# Altium project PCB_Project.PrjPcb
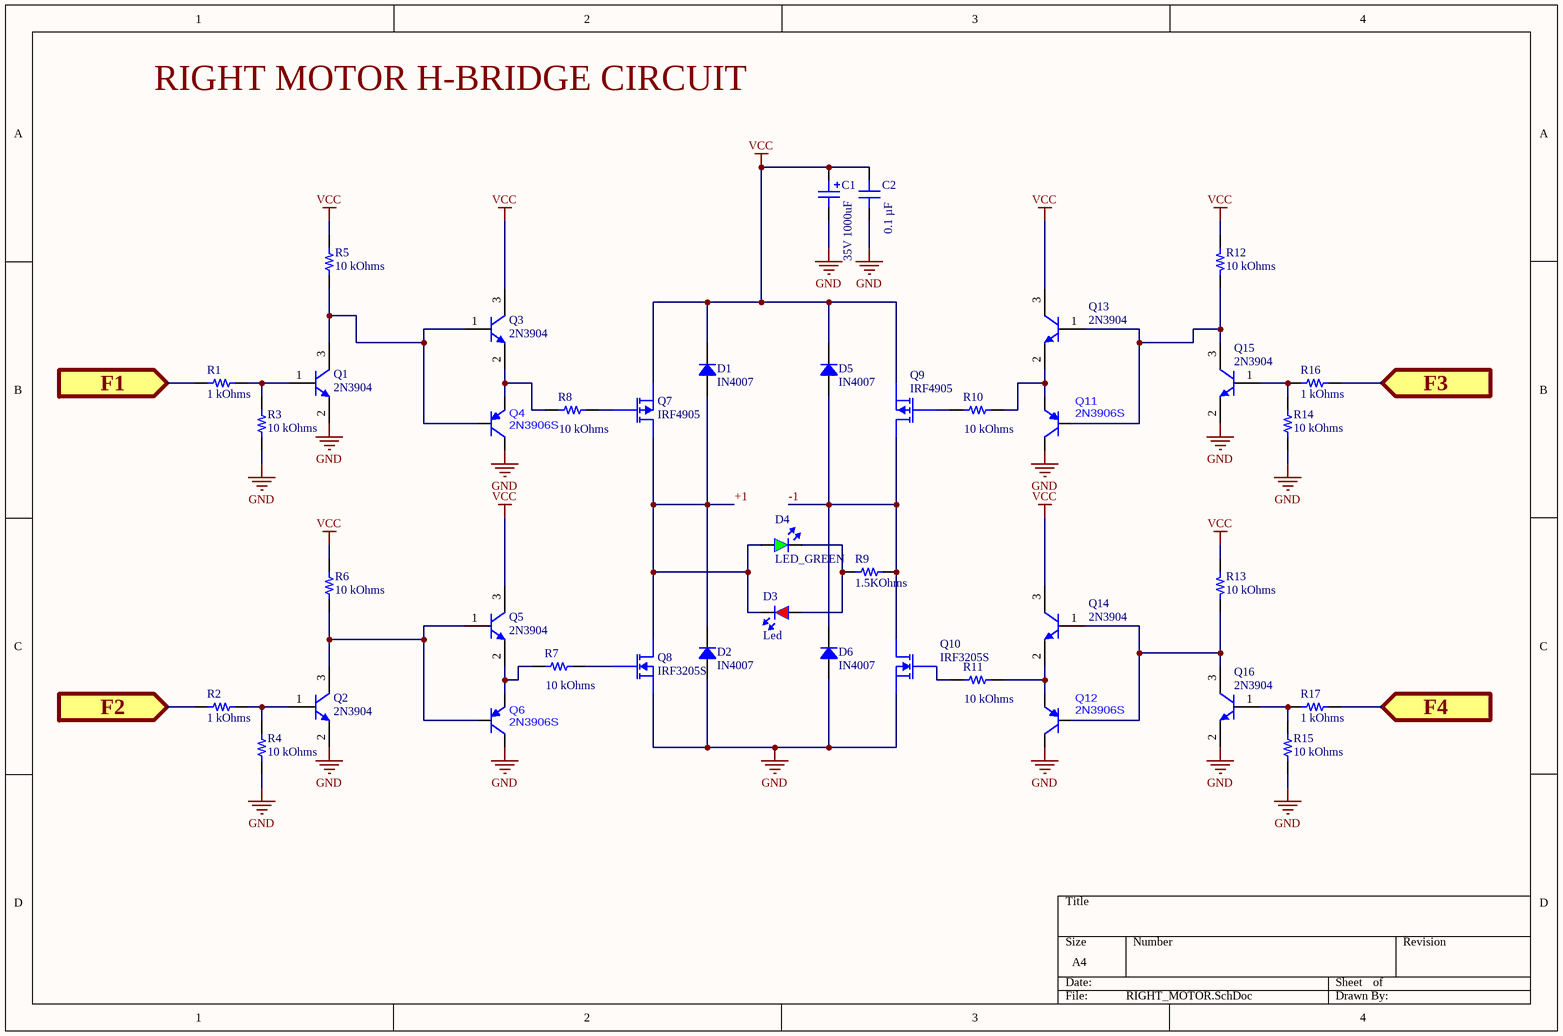
[diagram p0: RIGHT_MOTOR.SchDoc]
3 sheets, 114 parts. Net scope: global (net labels, ports and power ports of the same name join across sheets).
Board file: HBRIDGE_PCB.PcbDoc
Sheets:
  RIGHT_MOTOR.SchDoc
  LEFT_MOTOR.SchDoc
  LOGIC AND POWER.SchDoc

## Sheet RIGHT_MOTOR.SchDoc
size A4; SheetNumber: 1; SheetTotal: 3

### Parts
C1  35V 1000uF  [35V 1000uF]
C2  0.1 µF  [CAP 1210_3225 - 1MM]
D1  IN4007  [DO214AC SMA]
D2  IN4007  [DO214AC SMA]
D3  Led  [LED_RED]
D4  LED_GREEN  [LED_GREEN]
D5  IN4007  [DO214AC SMA]
D6  IN4007  [DO214AC SMA]
Q1  2N3904  [DIODES SOT-23-3]
Q2  2N3904  [DIODES SOT-23-3]
Q3  2N3904  [DIODES SOT-23-3]
Q4  2N3906S  [SOT23-3]
Q5  2N3904  [DIODES SOT-23-3]
Q6  2N3906S  [SOT23-3]
Q7  IRF4905  [IRF4905]
Q8  IRF3205S  [IRF3205S]
Q9  IRF4905  [IRF4905]
Q10  IRF3205S  [IRF3205S]
Q11  2N3906S  [SOT23-3]
Q12  2N3906S  [SOT23-3]
Q13  2N3904  [DIODES SOT-23-3]
Q14  2N3904  [DIODES SOT-23-3]
Q15  2N3904  [DIODES SOT-23-3]
Q16  2N3904  [DIODES SOT-23-3]
R1  1 kOhms  [RES 1206_3216]
R2  1 kOhms  [RES 1206_3216]
R3  10 kOhms  [RES 1206_3216]
R4  10 kOhms  [RES 1206_3216]
R5  10 kOhms  [RES 1210_3225]
R6  10 kOhms  [RES 1210_3225]
R7  10 kOhms  [RES 1210_3225]
R8  10 kOhms  [RES 1210_3225]
R9  1.5KOhms  [RES 1210_3225]
R10  10 kOhms  [RES 1210_3225]
R11  10 kOhms  [RES 1210_3225]
R12  10 kOhms  [RES 1210_3225]
R13  10 kOhms  [RES 1210_3225]
R14  10 kOhms  [RES 1206_3216]
R15  10 kOhms  [RES 1206_3216]
R16  1 kOhms  [RES 1206_3216]
R17  1 kOhms  [RES 1206_3216]

### Ports
F1 (in, see LOGIC AND POWER[2D]), F2 (in, see LOGIC AND POWER[2C], LOGIC AND POWER[2D]), F3 (in, see LOGIC AND POWER[2D]), F4 (in, see LOGIC AND POWER[2C], LOGIC AND POWER[2D])

### Nets
GND: C1.2(out) C2.1 D2.1 D6.1 Q1.2(E) Q2.2(E) Q4.3(C) Q6.3(C) Q8.3(S) Q10.3(S) Q11.3(C) Q12.3(C) Q15.2(E) Q16.2(E) R3.1 R4.1 R14.1 R15.1
VCC: C1.1(in) C2.2 D1.2 D5.2 Q3.3(C) Q5.3(C) Q7.3(S) Q9.3(S) Q13.3(C) Q14.3(C) R5.1 R6.1 R12.1 R13.1
+1: D1.1 D2.2 D3.2(OUT) D4.1(IN) Q7.2(D) Q8.2(D)
-1: D5.1 D6.2 Q9.2(D) Q10.2(D) R9.2
NetD3_1: D3.1(IN) D4.2(OUT) R9.1
NetIC1_3: R17.2 ; port F4
NetIC1_6: R2.1 ; port F2
NetIC2_4: R1.1 ; port F1
NetIC2_6: R16.2 ; port F3
NetQ1_1: Q1.1(B) R1.2 R3.2
NetQ1_3: Q1.3(C) Q3.1(B) Q4.1(B) R5.2
NetQ2_1: Q2.1(B) R2.2 R4.2
NetQ2_3: Q2.3(C) Q5.1(B) Q6.1(B) R6.2
NetQ3_2: Q3.2(E) Q4.2(E) R8.1
NetQ5_2: Q5.2(E) Q6.2(E) R7.1
NetQ7_1: Q7.1(G) R8.2
NetQ8_1: Q8.1(G) R7.2
NetQ9_1: Q9.1(G) R10.1
NetQ10_1: Q10.1(G) R11.1
NetQ11_1: Q11.1(B) Q13.1(B) Q15.3(C) R12.2
NetQ11_2: Q11.2(E) Q13.2(E) R10.2
NetQ12_1: Q12.1(B) Q14.1(B) Q16.3(C) R13.2
NetQ12_2: Q12.2(E) Q14.2(E) R11.2
NetQ15_1: Q15.1(B) R14.2 R16.1
NetQ16_1: Q16.1(B) R15.2 R17.1

### Notes on the sheet
- Labels drawn without touching a wire or pin: RIGHT MOTOR H-BRIDGE CIRCUIT

### Library data of the parts
C2 = 1210Y0500104KST: 1210 50VDC 100NF 10% X7R(2R1) AE; manufacturer: Knowles Syfer; Voltage - Rated: 50V; Part Number: 1210Y0500104KST; Value: 0.1 µF; Applications: Automotive, Boardflex Sensitive; Capacitance: 0.1 µF; componentlink2description: DigiKey Link; componentlink2url: https://www.digikey.com/en/products/detail/knowles-syfer/1210Y0500104KST/18879780; Device Package: 1210 (3225 Metric); Features: Soft Termination; lastupdated: 4.12.2023 20:40:02; Lifecycle Status: Active; Minimum Order: 1; Mounting Type: Surface Mount, MLCC; Operating Temperature: -55°C ~ 125°C; Package / Case: 1210 (3225 Metric); packaging: TapeAndReel; partid: 53037; Part Status: Active; price: 0.16; Ratings: AEC-Q200; series: FlexiCap™; Size / Dimension: 0.126" L x 0.098" W (3.20mm x 2.50mm); Supplier 1: DigiKey; Supplier Part Number 1: 1608-1210Y0500104KSTCT-ND; Temperature Coefficient: X7R (2R1); Thickness (Max): 0.079" (2.00mm); Tolerance: ±10%
D1 D2 D5 D6 = RS1A: DIODE GEN PURP 50V 1A SMA; Part Number: RS1A; Manufacturer: ON Semiconductor; Capacitance @ Vr, F: 10pF @ 4V, 1MHz; Current - Reverse Leakage @ Vr: 5µA @ 50V; Diode Type: Standard; Reverse Recovery Time (trr): 150ns; Speed: Fast Recovery =< 500ns, > 200mA (Io); Voltage - Forward (Vf) (Max) @ If: 1.3V @ 1A; ComponentLink1Description: Datasheet; ComponentLink1URL: https://www.onsemi.com/pub/Collateral/RS1M-D.PDF; ComponentLink2Description: DigiKey Link; ComponentLink2URL: http://digikey.com/product-detail/en/on-semiconductor/RS1A/RS1ACT-ND/3504478; Current - Average Rectified (Io): 1A; LastUpdated: 4.12.2023 21:20:44; Lifecycle Status: Active; Minimum Order: 1; Mounting Type: Surface Mount; Operating Temperature - Junction: -55°C ~ 150°C; Package / Case: DO-214AC, SMA; Packaging: TapeAndReel; PartId: 585; Part Status: Active; Price: 0.08; Series: -; Supplier 1: DigiKey; Supplier Part Number 1: RS1ACT-ND; Supplier Device Package: SMA (DO-214AC); Voltage - DC Reverse (Vr) (Max): 50V
D3 = LED_RED_1
Q1-Q3 Q5 Q13-Q16 = MMBT3904-7-F: 2N3904 Npn Smd Transistör Sot-23; Manufacturer: Diodes Incorporated; Current - Collector Cutoff (Max): 50nA (ICBO); Current - Collector (Ic) (Max): 200 mA; DC Current Gain (hFE) (Min) @ Ic, Vce: 100 @ 10mA, 1V; Frequency - Transition: 300MHz; Power - Max: 300 mW; Vce Saturation (Max) @ Ib, Ic: 300mV @ 5mA, 50mA; Voltage - Collector Emitter Breakdown (Max): 40 V; Part Number: MMBT3904-7-F; ComponentLink1Description: Datasheet; ComponentLink1URL: https://www.diodes.com/assets/Datasheets/ds30036.pdf; ComponentLink2Description: DigiKey Link; ComponentLink2URL: https://www.digikey.com/en/products/detail/diodes-incorporated/MMBT3904-7-F/814494; LastUpdated: 4.12.2023 21:46:05; Lifecycle Status: Active; Minimum Order: 1; Mounting Type: Surface Mount; Operating Temperature: -55°C ~ 150°C (TJ); Package / Case: TO-236-3, SC-59, SOT-23-3; Packaging: TapeAndReel; PartId: 85; Part Status: Active; Price: 0.01; Series: -; Supplier 1: DigiKey; Supplier Part Number 1: MMBT3904-FDICT-ND; Supplier Device Package: SOT-23-3; Transistor Type: NPN
R1 R2 R16 R17 = RNCS1206BKE1K00: RES 1K OHM 0.1% 1/8W 1206; Manufacturer: Stackpole Electronics Inc; Power (Watts): 0.125W, 1/8W; Temperature Coefficient: ±25ppm/°C; Part Number: RNCS1206BKE1K00; ComponentLink1Description: Datasheet; ComponentLink1URL: https://www.seielect.com/catalog/sei-rncs_rnch.pdf; ComponentLink2Description: DigiKey Link; ComponentLink2URL: https://www.digikey.com/en/products/detail/stackpole-electronics-inc/RNCS1206BKE1K00/1800333; Composition: Thin Film; Device Package: 1206 (3216 Metric); Features: Anti-Corrosive, Automotive AEC-Q200, Moisture Resistant; Height - Seated (Max): 0.026" (0.65mm); LastUpdated: 4.12.2023 20:49:28; Lifecycle Status: Active; Minimum Order: 1; Number of Terminations: 2; Operating Temperature: -55°C ~ 155°C; Package / Case: 1206 (3216 Metric); Packaging: TapeAndReel; PartId: 26856; Part Status: Active; Price: 0.08; Ratings: AEC-Q200; Resistance: 1 kOhms; Series: RNCS; Size / Dimension: 0.120" L x 0.061" W (3.05mm x 1.55mm); Supplier 1: DigiKey; Supplier Part Number 1: RNCS1206BKE1K00CT-ND; Supplier Device Package: 1206; Tolerance: ±0.1%; Value: 1 kOhms
R3 R4 R14 R15 = CRG1206F10K: RES SMD 10K OHM 1% 1/4W 1206; Manufacturer: TE Connectivity Passive Product; Power (Watts): 0.25W, 1/4W; Temperature Coefficient: ±100ppm/°C; Part Number: CRG1206F10K; ComponentLink1Description: Datasheet; ComponentLink1URL: https://www.te.com/commerce/DocumentDelivery/DDEController?Action=srchrtrv&DocNm=1773204&DocType=DS&DocLang=English; ComponentLink2Description: DigiKey Link; ComponentLink2URL: https://www.digikey.com/en/products/detail/te-connectivity-passive-product/CRG1206F10K/2389909; Composition: Thick Film; Device Package: 1206 (3216 Metric); Height - Seated (Max): 0.026" (0.65mm); LastUpdated: 10.12.2023 20:48:33; Lifecycle Status: Active; Minimum Order: 1; Number of Terminations: 2; Operating Temperature: -55°C ~ 155°C; Package / Case: 1206 (3216 Metric); Packaging: TapeAndReel; PartId: 26989; Part Status: Active; Price: 0.01; Resistance: 10 kOhms; Series: CRG, Neohm; Size / Dimension: 0.122" L x 0.061" W (3.10mm x 1.55mm); Supplier 1: DigiKey; Supplier Part Number 1: A106069CT-ND; Supplier Device Package: 1206; Tolerance: ±1%; Value: 10 kOhms
R5 R6 R12 R13 = CRCW121010K0JNEAHP: RES SMD 10K OHM 5% 3/4W 1210; Manufacturer: Vishay Dale; Power (Watts): 0.75W, 3/4W; Temperature Coefficient: ±200ppm/°C; Part Number: CRCW121010K0JNEAHP; ComponentLink1Description: Datasheet; ComponentLink1URL: http://www.vishay.com/docs/20043/crcwhpe3.pdf; ComponentLink2Description: DigiKey Link; ComponentLink2URL: https://www.digikey.com/en/products/detail/vishay-dale/CRCW121010K0JNEAHP/2567300; Composition: Thick Film; Device Package: 1210 (3225 Metric); Features: Automotive AEC-Q200, Pulse Withstanding; Height - Seated (Max): 0.028" (0.70mm); LastUpdated: 4.12.2023 21:41:47; Lifecycle Status: Active; Minimum Order: 1; Number of Terminations: 2; Operating Temperature: -55°C ~ 155°C; Package / Case: 1210 (3225 Metric); Packaging: TapeAndReel; Part Status: Active; Price: 0.12; Ratings: AEC-Q200; Resistance: 10 kOhms; Series: CRCW-HP; Size / Dimension: 0.126" L x 0.098" W (3.20mm x 2.50mm); Supplier 1: DigiKey; Supplier Part Number 1: 541-10KNCT-ND; Supplier Device Package: 1210; Tolerance: ±5%; Value: 10 kOhms
R7 R8 R10 R11 = RMCF1210FT10K0: RES 10K OHM 1% 1/2W 1210; Manufacturer: Stackpole Electronics Inc; Power (Watts): 0.5W, 1/2W; Temperature Coefficient: ±100ppm/°C; Part Number: RMCF1210FT10K0; ComponentLink1Description: Datasheet; ComponentLink1URL: https://www.seielect.com/catalog/sei-rmcf_rmcp.pdf; ComponentLink2Description: DigiKey Link; ComponentLink2URL: https://www.digikey.com/en/products/detail/stackpole-electronics-inc/RMCF1210FT10K0/1758528; Composition: Thick Film; Device Package: 1210 (3225 Metric); Features: Automotive AEC-Q200; Height - Seated (Max): 0.028" (0.70mm); LastUpdated: 10.12.2023 21:39:36; Lifecycle Status: Active; Minimum Order: 1; Number of Terminations: 2; Operating Temperature: -55°C ~ 155°C; Package / Case: 1210 (3225 Metric); Packaging: TapeAndReel; Part Status: Active; Price: 0.01; Ratings: AEC-Q200; Resistance: 10 kOhms; Series: RMCF; Size / Dimension: 0.126" L x 0.098" W (3.20mm x 2.50mm); Supplier 1: DigiKey; Supplier Part Number 1: RMCF1210FT10K0CT-ND; Supplier Device Package: 1210; Tolerance: ±1%; Value: 10 kOhms
R9 = RMCF1210FT10K0: RES 1.5K OHM 1% 1/2W 1210; Manufacturer: Stackpole Electronics Inc; Power (Watts): 0.5W, 1/2W; Resistance: 10 kOhms; Temperature Coefficient: ±100ppm/°C; Value: 10 kOhms; Part Number: RMCF1210FT10K0; ComponentLink1Description: Datasheet; ComponentLink1URL: https://www.seielect.com/catalog/sei-rmcf_rmcp.pdf; ComponentLink2Description: DigiKey Link; ComponentLink2URL: https://www.digikey.com/en/products/detail/stackpole-electronics-inc/RMCF1210FT10K0/1758528; Composition: Thick Film; Device Package: 1210 (3225 Metric); Features: Automotive AEC-Q200; Height - Seated (Max): 0.028" (0.70mm); LastUpdated: 4.12.2023 21:41:44; Lifecycle Status: Active; Minimum Order: 1; Number of Terminations: 2; Operating Temperature: -55°C ~ 155°C; Package / Case: 1210 (3225 Metric); Packaging: TapeAndReel; Part Status: Active; Price: 0.01; Ratings: AEC-Q200; Series: RMCF; Size / Dimension: 0.126" L x 0.098" W (3.20mm x 2.50mm); Supplier 1: DigiKey; Supplier Part Number 1: RMCF1210FT10K0CT-ND; Supplier Device Package: 1210; Tolerance: ±1%

## Sheet LEFT_MOTOR.SchDoc
size A4; SheetNumber: 2; SheetTotal: 3
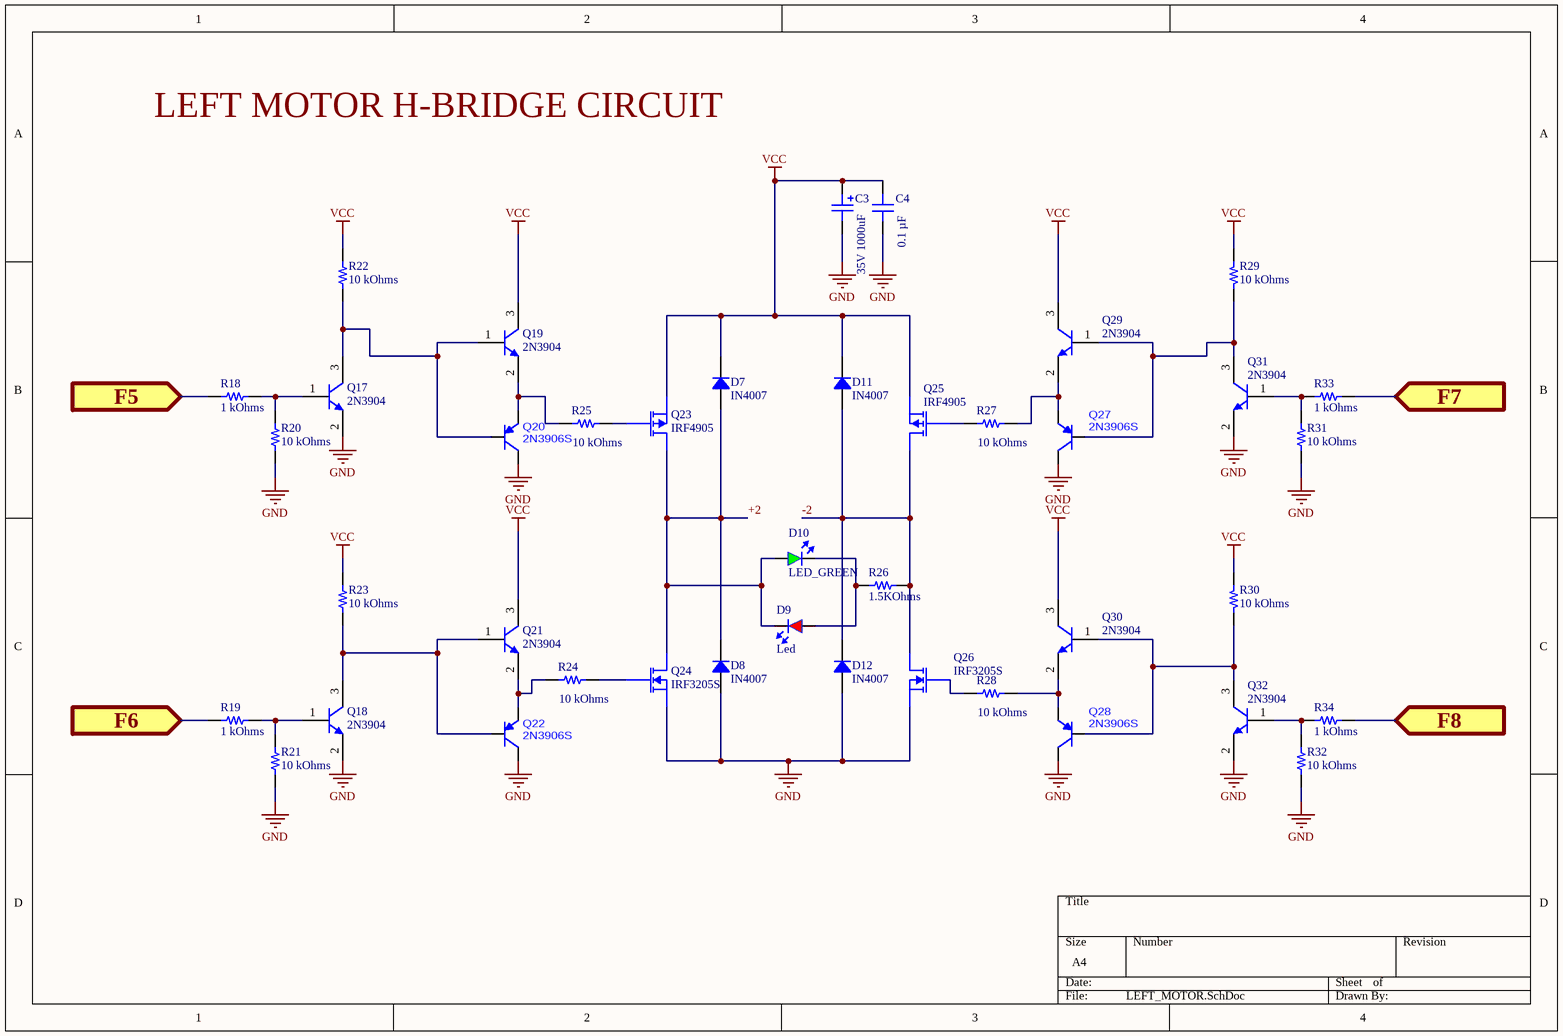
[diagram p1: LEFT_MOTOR.SchDoc]

### Parts
C3  35V 1000uF  [35V 1000uF]
C4  0.1 µF  [CAP 1210_3225 - 1MM]
D7  IN4007  [DO214AC SMA]
D8  IN4007  [DO214AC SMA]
D9  Led  [LED_RED]
D10  LED_GREEN  [LED_GREEN]
D11  IN4007  [DO214AC SMA]
D12  IN4007  [DO214AC SMA]
Q17  2N3904  [DIODES SOT-23-3]
Q18  2N3904  [DIODES SOT-23-3]
Q19  2N3904  [DIODES SOT-23-3]
Q20  2N3906S  [SOT23-3]
Q21  2N3904  [DIODES SOT-23-3]
Q22  2N3906S  [SOT23-3]
Q23  IRF4905  [IRF4905]
Q24  IRF3205S  [IRF3205S]
Q25  IRF4905  [IRF4905]
Q26  IRF3205S  [IRF3205S]
Q27  2N3906S  [SOT23-3]
Q28  2N3906S  [SOT23-3]
Q29  2N3904  [DIODES SOT-23-3]
Q30  2N3904  [DIODES SOT-23-3]
Q31  2N3904  [DIODES SOT-23-3]
Q32  2N3904  [DIODES SOT-23-3]
R18  1 kOhms  [RES 1206_3216]
R19  1 kOhms  [RES 1206_3216]
R20  10 kOhms  [RES 1206_3216]
R21  10 kOhms  [RES 1206_3216]
R22  10 kOhms  [RES 1210_3225]
R23  10 kOhms  [RES 1210_3225]
R24  10 kOhms  [RES 1210_3225]
R25  10 kOhms  [RES 1210_3225]
R26  1.5KOhms  [RES 1210_3225]
R27  10 kOhms  [RES 1210_3225]
R28  10 kOhms  [RES 1210_3225]
R29  10 kOhms  [RES 1210_3225]
R30  10 kOhms  [RES 1210_3225]
R31  10 kOhms  [RES 1206_3216]
R32  10 kOhms  [RES 1206_3216]
R33  1 kOhms  [RES 1206_3216]
R34  1 kOhms  [RES 1206_3216]

### Ports
F5 (in, see LOGIC AND POWER[2D]), F6 (in, see LOGIC AND POWER[2C], LOGIC AND POWER[2D]), F7 (in, see LOGIC AND POWER[2D]), F8 (in, see LOGIC AND POWER[2C], LOGIC AND POWER[2D])

### Nets
GND: C3.2(out) C4.1 D8.1 D12.1 Q17.2(E) Q18.2(E) Q20.3(C) Q22.3(C) Q24.3(S) Q26.3(S) Q27.3(C) Q28.3(C) Q31.2(E) Q32.2(E) R20.1 R21.1 R31.1 R32.1
VCC: C3.1(in) C4.2 D7.2 D11.2 Q19.3(C) Q21.3(C) Q23.3(S) Q25.3(S) Q29.3(C) Q30.3(C) R22.1 R23.1 R29.1 R30.1
+2: D7.1 D8.2 D9.2(OUT) D10.1(IN) Q23.2(D) Q24.2(D)
-2: D11.1 D12.2 Q25.2(D) Q26.2(D) R26.2
NetD9_1: D9.1(IN) D10.2(OUT) R26.1
NetIC1_8: R34.2 ; port F8
NetIC1_11: R19.1 ; port F6
NetIC2_8: R33.2 ; port F7
NetIC2_10: R18.1 ; port F5
NetQ17_1: Q17.1(B) R18.2 R20.2
NetQ17_3: Q17.3(C) Q19.1(B) Q20.1(B) R22.2
NetQ18_1: Q18.1(B) R19.2 R21.2
NetQ18_3: Q18.3(C) Q21.1(B) Q22.1(B) R23.2
NetQ19_2: Q19.2(E) Q20.2(E) R25.1
NetQ21_2: Q21.2(E) Q22.2(E) R24.1
NetQ23_1: Q23.1(G) R25.2
NetQ24_1: Q24.1(G) R24.2
NetQ25_1: Q25.1(G) R27.1
NetQ26_1: Q26.1(G) R28.1
NetQ27_1: Q27.1(B) Q29.1(B) Q31.3(C) R29.2
NetQ27_2: Q27.2(E) Q29.2(E) R27.2
NetQ28_1: Q28.1(B) Q30.1(B) Q32.3(C) R30.2
NetQ28_2: Q28.2(E) Q30.2(E) R28.2
NetQ31_1: Q31.1(B) R31.2 R33.1
NetQ32_1: Q32.1(B) R32.2 R34.1

### Notes on the sheet
- Labels drawn without touching a wire or pin: LEFT MOTOR H-BRIDGE CIRCUIT

### Library data of the parts
C4 = 1210Y0500104KST: as C2 on sheet RIGHT_MOTOR; Part Number: 1210Y0500104KST; Value: 0.1 µF; Applications: Automotive, Boardflex Sensitive; Capacitance: 0.1 µF; componentlink2description: DigiKey Link; componentlink2url: https://www.digikey.com/en/products/detail/knowles-syfer/1210Y0500104KST/18879780; Device Package: 1210 (3225 Metric); Features: Soft Termination; lastupdated: 4.12.2023 20:40:02; Lifecycle Status: Active; Minimum Order: 1; Mounting Type: Surface Mount, MLCC; Operating Temperature: -55°C ~ 125°C; Package / Case: 1210 (3225 Metric); packaging: TapeAndReel; partid: 53037; Part Status: Active; price: 0.16; Ratings: AEC-Q200; series: FlexiCap™; Size / Dimension: 0.126" L x 0.098" W (3.20mm x 2.50mm); Supplier 1: DigiKey; Supplier Part Number 1: 1608-1210Y0500104KSTCT-ND; Temperature Coefficient: X7R (2R1); Thickness (Max): 0.079" (2.00mm); Tolerance: ±10%
D7 D8 D11 D12 = RS1A: as D1 on sheet RIGHT_MOTOR; ComponentLink1Description: Datasheet; ComponentLink1URL: https://www.onsemi.com/pub/Collateral/RS1M-D.PDF; ComponentLink2Description: DigiKey Link; ComponentLink2URL: http://digikey.com/product-detail/en/on-semiconductor/RS1A/RS1ACT-ND/3504478; Current - Average Rectified (Io): 1A; LastUpdated: 4.12.2023 21:20:44; Lifecycle Status: Active; Minimum Order: 1; Mounting Type: Surface Mount; Operating Temperature - Junction: -55°C ~ 150°C; Package / Case: DO-214AC, SMA; Packaging: TapeAndReel; PartId: 585; Part Status: Active; Price: 0.08; Series: -; Supplier 1: DigiKey; Supplier Part Number 1: RS1ACT-ND; Supplier Device Package: SMA (DO-214AC); Voltage - DC Reverse (Vr) (Max): 50V
D9 = LED_RED_1
Q17-Q19 Q21 Q29-Q32 = MMBT3904-7-F: as Q1 on sheet RIGHT_MOTOR; Part Number: MMBT3904-7-F; ComponentLink1Description: Datasheet; ComponentLink1URL: https://www.diodes.com/assets/Datasheets/ds30036.pdf; ComponentLink2Description: DigiKey Link; ComponentLink2URL: https://www.digikey.com/en/products/detail/diodes-incorporated/MMBT3904-7-F/814494; LastUpdated: 4.12.2023 21:46:05; Lifecycle Status: Active; Minimum Order: 1; Mounting Type: Surface Mount; Operating Temperature: -55°C ~ 150°C (TJ); Package / Case: TO-236-3, SC-59, SOT-23-3; Packaging: TapeAndReel; PartId: 85; Part Status: Active; Price: 0.01; Series: -; Supplier 1: DigiKey; Supplier Part Number 1: MMBT3904-FDICT-ND; Supplier Device Package: SOT-23-3; Transistor Type: NPN
R18 R19 R33 R34 = RNCS1206BKE1K00: as R1 on sheet RIGHT_MOTOR; Part Number: RNCS1206BKE1K00; ComponentLink1Description: Datasheet; ComponentLink1URL: https://www.seielect.com/catalog/sei-rncs_rnch.pdf; ComponentLink2Description: DigiKey Link; ComponentLink2URL: https://www.digikey.com/en/products/detail/stackpole-electronics-inc/RNCS1206BKE1K00/1800333; Composition: Thin Film; Device Package: 1206 (3216 Metric); Features: Anti-Corrosive, Automotive AEC-Q200, Moisture Resistant; Height - Seated (Max): 0.026" (0.65mm); LastUpdated: 4.12.2023 20:49:28; Lifecycle Status: Active; Minimum Order: 1; Number of Terminations: 2; Operating Temperature: -55°C ~ 155°C; Package / Case: 1206 (3216 Metric); Packaging: TapeAndReel; PartId: 26856; Part Status: Active; Price: 0.08; Ratings: AEC-Q200; Resistance: 1 kOhms; Series: RNCS; Size / Dimension: 0.120" L x 0.061" W (3.05mm x 1.55mm); Supplier 1: DigiKey; Supplier Part Number 1: RNCS1206BKE1K00CT-ND; Supplier Device Package: 1206; Tolerance: ±0.1%; Value: 1 kOhms
R20 R21 R31 R32 = CRG1206F10K: as R3 on sheet RIGHT_MOTOR; Part Number: CRG1206F10K; ComponentLink1Description: Datasheet; ComponentLink1URL: https://www.te.com/commerce/DocumentDelivery/DDEController?Action=srchrtrv&DocNm=1773204&DocType=DS&DocLang=English; ComponentLink2Description: DigiKey Link; ComponentLink2URL: https://www.digikey.com/en/products/detail/te-connectivity-passive-product/CRG1206F10K/2389909; Composition: Thick Film; Device Package: 1206 (3216 Metric); Height - Seated (Max): 0.026" (0.65mm); LastUpdated: 10.12.2023 20:48:33; Lifecycle Status: Active; Minimum Order: 1; Number of Terminations: 2; Operating Temperature: -55°C ~ 155°C; Package / Case: 1206 (3216 Metric); Packaging: TapeAndReel; PartId: 26989; Part Status: Active; Price: 0.01; Resistance: 10 kOhms; Series: CRG, Neohm; Size / Dimension: 0.122" L x 0.061" W (3.10mm x 1.55mm); Supplier 1: DigiKey; Supplier Part Number 1: A106069CT-ND; Supplier Device Package: 1206; Tolerance: ±1%; Value: 10 kOhms
R22 R23 R29 R30 = CRCW121010K0JNEAHP: as R5 on sheet RIGHT_MOTOR; Part Number: CRCW121010K0JNEAHP; ComponentLink1Description: Datasheet; ComponentLink1URL: http://www.vishay.com/docs/20043/crcwhpe3.pdf; ComponentLink2Description: DigiKey Link; ComponentLink2URL: https://www.digikey.com/en/products/detail/vishay-dale/CRCW121010K0JNEAHP/2567300; Composition: Thick Film; Device Package: 1210 (3225 Metric); Features: Automotive AEC-Q200, Pulse Withstanding; Height - Seated (Max): 0.028" (0.70mm); LastUpdated: 4.12.2023 21:41:47; Lifecycle Status: Active; Minimum Order: 1; Number of Terminations: 2; Operating Temperature: -55°C ~ 155°C; Package / Case: 1210 (3225 Metric); Packaging: TapeAndReel; Part Status: Active; Price: 0.12; Ratings: AEC-Q200; Resistance: 10 kOhms; Series: CRCW-HP; Size / Dimension: 0.126" L x 0.098" W (3.20mm x 2.50mm); Supplier 1: DigiKey; Supplier Part Number 1: 541-10KNCT-ND; Supplier Device Package: 1210; Tolerance: ±5%; Value: 10 kOhms
R24 R25 R27 R28 = RMCF1210FT10K0: as R7 on sheet RIGHT_MOTOR; Part Number: RMCF1210FT10K0; ComponentLink1Description: Datasheet; ComponentLink1URL: https://www.seielect.com/catalog/sei-rmcf_rmcp.pdf; ComponentLink2Description: DigiKey Link; ComponentLink2URL: https://www.digikey.com/en/products/detail/stackpole-electronics-inc/RMCF1210FT10K0/1758528; Composition: Thick Film; Device Package: 1210 (3225 Metric); Features: Automotive AEC-Q200; Height - Seated (Max): 0.028" (0.70mm); LastUpdated: 10.12.2023 21:39:36; Lifecycle Status: Active; Minimum Order: 1; Number of Terminations: 2; Operating Temperature: -55°C ~ 155°C; Package / Case: 1210 (3225 Metric); Packaging: TapeAndReel; Part Status: Active; Price: 0.01; Ratings: AEC-Q200; Resistance: 10 kOhms; Series: RMCF; Size / Dimension: 0.126" L x 0.098" W (3.20mm x 2.50mm); Supplier 1: DigiKey; Supplier Part Number 1: RMCF1210FT10K0CT-ND; Supplier Device Package: 1210; Tolerance: ±1%; Value: 10 kOhms
R26 = RMCF1210FT10K0: RES 10K OHM 1% 1/2W 1210; Manufacturer: Stackpole Electronics Inc; Power (Watts): 0.5W, 1/2W; Resistance: 10 kOhms; Temperature Coefficient: ±100ppm/°C; Value: 10 kOhms; Part Number: RMCF1210FT10K0; ComponentLink1Description: Datasheet; ComponentLink1URL: https://www.seielect.com/catalog/sei-rmcf_rmcp.pdf; ComponentLink2Description: DigiKey Link; ComponentLink2URL: https://www.digikey.com/en/products/detail/stackpole-electronics-inc/RMCF1210FT10K0/1758528; Composition: Thick Film; Device Package: 1210 (3225 Metric); Features: Automotive AEC-Q200; Height - Seated (Max): 0.028" (0.70mm); LastUpdated: 4.12.2023 21:41:44; Lifecycle Status: Active; Minimum Order: 1; Number of Terminations: 2; Operating Temperature: -55°C ~ 155°C; Package / Case: 1210 (3225 Metric); Packaging: TapeAndReel; Part Status: Active; Price: 0.01; Ratings: AEC-Q200; Series: RMCF; Size / Dimension: 0.126" L x 0.098" W (3.20mm x 2.50mm); Supplier 1: DigiKey; Supplier Part Number 1: RMCF1210FT10K0CT-ND; Supplier Device Package: 1210; Tolerance: ±1%

## Sheet LOGIC AND POWER.SchDoc
size A4; SheetNumber: 3; SheetTotal: 3
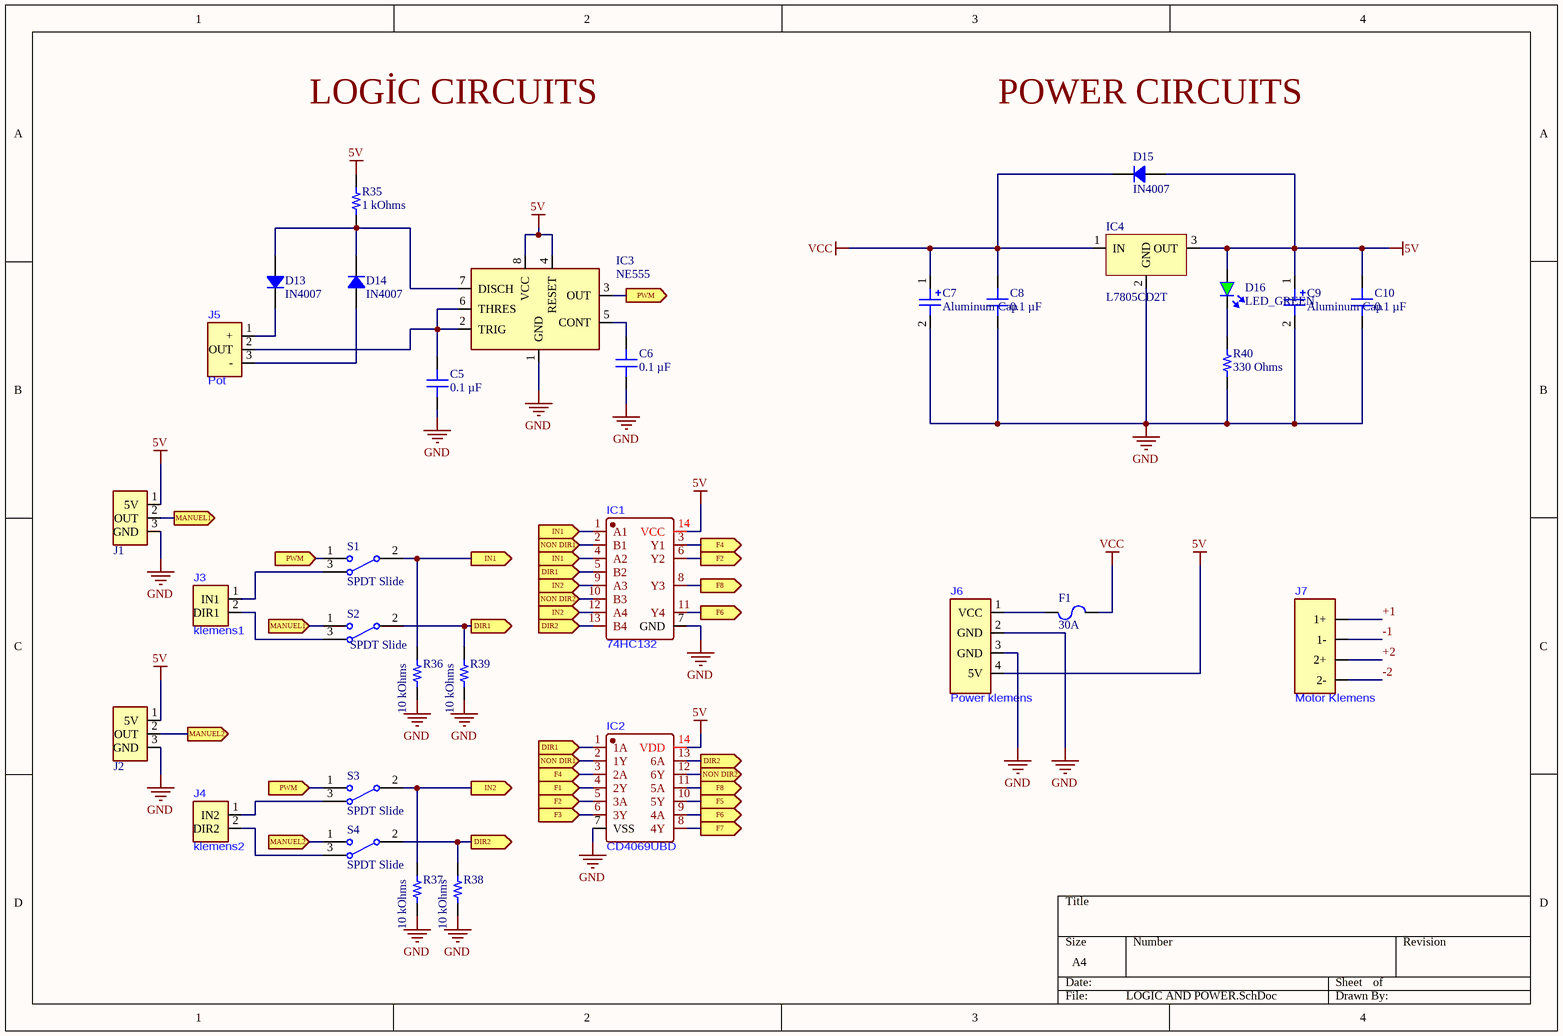
[diagram p2: LOGIC AND POWER.SchDoc]

### Parts
C5  0.1 µF  [CAP 1210_3225 - 1MM]
C6  0.1 µF  [CAP 1210_3225 - 1MM]
C7  Aluminum Cap  [Aluminum Cap]
C8  0.1 µF  [CAP 1210_3225 - 1MM]
C9  Aluminum Cap  [Aluminum Cap]
C10  0.1 µF  [CAP 1210_3225 - 1MM]
D13  IN4007  [DO214AC SMA]
D14  IN4007  [DO214AC SMA]
D15  IN4007  [DO214AC SMA]
D16  LED_GREEN  [LED_GREEN]
F1  30A  [FUSE 1206_3216 0.6MM]
IC1  74HC132  [SOIC14]
IC2  CD4069UBD  [SOIC14]
IC3  NE555  [NE5532-SOIC8]
IC4  L7805CD2T  [L7805CD2T]
J1  Switch  [JST-XH 2.54 - duplicate]  (value not drawn)
J2  Switch  [JST-XH 2.54 - duplicate]  (value not drawn)
J3  klemens1  [Klemens]
J4  klemens2  [Klemens]
J5  Pot  [JST-XH 2.54]
J6  Power klemens  [Power Klemens]
J7  Motor Klemens  [Power Klemens]
R35  1 kOhms  [RES 1206_3216]
R36  10 kOhms  [RES 1210_3225]
R37  10 kOhms  [RES 1210_3225]
R38  10 kOhms  [RES 1210_3225]
R39  10 kOhms  [RES 1210_3225]
R40  330 Ohms  [RES 1210_3225]
S1  SPDT Slide  [SPDT]
S2  SPDT Slide  [SPDT]
S3  SPDT Slide  [SPDT]
S4  SPDT Slide  [SPDT]

### Ports
DIR1 (in, see LOGIC AND POWER[2C]), DIR1 (out, see LOGIC AND POWER[2C]), DIR2 (in, see LOGIC AND POWER[2C], LOGIC AND POWER[2D]), DIR2 (out, see LOGIC AND POWER[2C]), DIR2 (out, see LOGIC AND POWER[2C], LOGIC AND POWER[2D]), F1 (in, see RIGHT_MOTOR[1B]), F2 (in, see LOGIC AND POWER[2C], RIGHT_MOTOR[1C]), F2 (out, see LOGIC AND POWER[2D], RIGHT_MOTOR[1C]), F3 (in, see RIGHT_MOTOR[4B]), F4 (in, see LOGIC AND POWER[2C], RIGHT_MOTOR[4C]), F4 (out, see LOGIC AND POWER[2D], RIGHT_MOTOR[4C]), F5 (out, see LEFT_MOTOR[1B]), F6 (out, see LEFT_MOTOR[1C], LOGIC AND POWER[2C]), F6 (out, see LEFT_MOTOR[1C], LOGIC AND POWER[2D]), F7 (out, see LEFT_MOTOR[4B]), F8 (out, see LEFT_MOTOR[4C], LOGIC AND POWER[2C]), F8 (out, see LEFT_MOTOR[4C], LOGIC AND POWER[2D]), IN1 (in, see LOGIC AND POWER[2C]), IN1 (out, see LOGIC AND POWER[2C]), IN2 (in, see LOGIC AND POWER[2C], LOGIC AND POWER[2D]), IN2 (out, see LOGIC AND POWER[2C]), MANUEL1 (in, see LOGIC AND POWER[1C]), MANUEL1 (out, see LOGIC AND POWER[1C]), MANUEL2 (in, see LOGIC AND POWER[1C]), MANUEL2 (out, see LOGIC AND POWER[1D]), NON DIR1 (in, see LOGIC AND POWER[2C]), NON DIR2 (in, see LOGIC AND POWER[2D]), NON DIR2 (out, see LOGIC AND POWER[2C]), PWM (in, see LOGIC AND POWER[1C], LOGIC AND POWER[2B]), PWM (in, see LOGIC AND POWER[1D], LOGIC AND POWER[2B]), PWM (out, see LOGIC AND POWER[1C], LOGIC AND POWER[1D])

### Nets
5V: C9.1(in) C10.2 D15.1 D16.1(IN) IC1.14(VCC) IC2.14(VDD) IC3.4(RESET) IC3.8(VCC) IC4.3(OUT) J1.1(5V) J2.1(5V) J6.4(5V) R35.1
GND: C5.1 C6.1 C7.2(out) C8.1 C9.2(out) C10.1 IC1.7(GND) IC2.7(VSS) IC3.1(GND) IC4.2(GND) J1.3(GND) J2.3(GND) J6.2(GND) J6.3(GND) R36.1 R37.1 R38.1 R39.1 R40.1
VCC: C7.1(in) C8.2 D15.2 F1.2 IC4.1(IN)
+1: J7.1(1+)
+2: J7.3(2+)
-1: J7.2(1-)
-2: J7.4(2-)
NetC5_2: C5.2 IC3.2(TRIG) IC3.6(THRES) J5.2(OUT)
NetC6_2: C6.2 IC3.5(CONT)
NetD13_1: D13.1 D14.2 IC3.7(DISCH) R35.2
NetD13_2: D13.2 J5.1(+)
NetD14_1: D14.1 J5.3(-)
NetD16_2: D16.2(OUT) R40.2
NetF1_1: F1.1 J6.1(VCC)
NetIC1_1: IC1.1(A1) IC1.4(A2) R36.2 S1.2 ; port IN1
NetIC1_2: IC1.2(B1) IC2.2(1Y) ; port NON DIR1
NetIC1_3: IC1.3(Y1) IC2.3(2A) ; port F4
NetIC1_5: IC1.5(B2) IC2.1(1A) R39.2 S2.2 ; port DIR1
NetIC1_6: IC1.6(Y2) IC2.5(3A) ; port F2
NetIC1_8: IC1.8(Y3) IC2.11(5A) ; port F8
NetIC1_9: IC1.9(A3) IC1.12(A4) R37.2 S3.2 ; port IN2
NetIC1_10: IC1.10(B3) IC2.12(6Y) ; port NON DIR2
NetIC1_11: IC1.11(Y4) IC2.9(4A) ; port F6
NetIC1_13: IC1.13(B4) IC2.13(6A) R38.2 S4.2 ; port DIR2
NetIC2_4: IC2.4(2Y) ; port F1
NetIC2_6: IC2.6(3Y) ; port F3
NetIC2_8: IC2.8(4Y) ; port F7
NetIC2_10: IC2.10(5Y) ; port F5
NetIC3_3: IC3.3(OUT) S1.1(PWM) S3.1(PWM) ; port PWM
NetJ1_2: J1.2(OUT) S2.1(MANUEL) ; port MANUEL1
NetJ2_2: J2.2(OUT) S4.1(MANUEL) ; port MANUEL2
NetJ3_1: J3.1(IN1) S1.3(MCU)
NetJ3_2: J3.2(DIR1) S2.3(MCU)
NetJ4_1: J4.1(IN2) S3.3(MCU)
NetJ4_2: J4.2(DIR2) S4.3(MCU)

### Notes on the sheet
- Labels drawn without touching a wire or pin: LOGİC CIRCUITS, POWER CIRCUITS

### Library data of the parts
C5 C6 C8 C10 = 1210Y0500104KST: as C2 on sheet RIGHT_MOTOR; Part Number: 1210Y0500104KST; Value: 0.1 µF; Applications: Automotive, Boardflex Sensitive; Capacitance: 0.1 µF; componentlink2description: DigiKey Link; componentlink2url: https://www.digikey.com/en/products/detail/knowles-syfer/1210Y0500104KST/18879780; Device Package: 1210 (3225 Metric); Features: Soft Termination; Lifecycle Status: Active; Minimum Order: 1; Mounting Type: Surface Mount, MLCC; Operating Temperature: -55°C ~ 125°C; Package / Case: 1210 (3225 Metric); packaging: TapeAndReel; partid: 53037; Part Status: Active; price: 0.16; Ratings: AEC-Q200; series: FlexiCap™; Size / Dimension: 0.126" L x 0.098" W (3.20mm x 2.50mm); Supplier 1: DigiKey; Supplier Part Number 1: 1608-1210Y0500104KSTCT-ND; Temperature Coefficient: X7R (2R1); Thickness (Max): 0.079" (2.00mm); Tolerance: ±10%
  C5 C6: lastupdated: 18.12.2023 20:42:16
  C8 C10: lastupdated: 5.12.2023 20:39:07
D13-D15 = RS1A: as D1 on sheet RIGHT_MOTOR; ComponentLink1Description: Datasheet; ComponentLink1URL: https://www.onsemi.com/pub/Collateral/RS1M-D.PDF; ComponentLink2Description: DigiKey Link; ComponentLink2URL: http://digikey.com/product-detail/en/on-semiconductor/RS1A/RS1ACT-ND/3504478; Current - Average Rectified (Io): 1A; LastUpdated: 4.12.2023 21:20:44; Lifecycle Status: Active; Minimum Order: 1; Mounting Type: Surface Mount; Operating Temperature - Junction: -55°C ~ 150°C; Package / Case: DO-214AC, SMA; Packaging: TapeAndReel; PartId: 585; Part Status: Active; Price: 0.08; Series: -; Supplier 1: DigiKey; Supplier Part Number 1: RS1ACT-ND; Supplier Device Package: SMA (DO-214AC); Voltage - DC Reverse (Vr) (Max): 50V
F1 = 3413.0120.22: FUSE BOARD MNT 2.5A 32VAC 63VDC; Manufacturer: Schurter Inc.; Approval Agency: cURus; Breaking Capacity @ Rated Voltage: 50A; Fuse Type: Board Mount (Cartridge Style Excluded); Melting I²t: 0.35; Response Time: Fast Blow; Voltage Rating - AC: 32V; Voltage Rating - DC: 63V; Part Number: 3413.0120.22; Approvals: cURus; ComponentLink1Description: Datasheet; ComponentLink1URL: http://www.schurterinc.com/bundles/snceschurter/epim/_ProdPool_/newDS/en/typ_USF_1206.pdf; ComponentLink2Description: DigiKey Link; ComponentLink2URL: http://digikey.com/product-detail/en/schurter-inc/3413.0120.22/486-1681-1-ND/2870086; Current Rating (Amps): 2.5A; Device Package: 1206 (3216 Metric); LastUpdated: 2.09.2020 01:30:41; Lifecycle Status: Active; Minimum Order: 1; Mounting Type: Surface Mount; Operating Temperature: -55°C ~ 90°C; Package / Case: 1206 (3216 Metric); Packaging: TapeAndReel; Part Status: Active; Price: 0.24; Series: USF 1206; Size / Dimension: 0.126" L x 0.063" W x 0.024" H (3.20mm x 1.60mm x 0.60mm); Supplier 1: DigiKey; Supplier Part Number 1: 486-1681-1-ND
R35 = RNCS1206BKE1K00: as R1 on sheet RIGHT_MOTOR; Part Number: RNCS1206BKE1K00; ComponentLink1Description: Datasheet; ComponentLink1URL: https://www.seielect.com/catalog/sei-rncs_rnch.pdf; ComponentLink2Description: DigiKey Link; ComponentLink2URL: https://www.digikey.com/en/products/detail/stackpole-electronics-inc/RNCS1206BKE1K00/1800333; Composition: Thin Film; Device Package: 1206 (3216 Metric); Features: Anti-Corrosive, Automotive AEC-Q200, Moisture Resistant; Height - Seated (Max): 0.026" (0.65mm); LastUpdated: 8.12.2023 20:55:21; Lifecycle Status: Active; Minimum Order: 1; Number of Terminations: 2; Operating Temperature: -55°C ~ 155°C; Package / Case: 1206 (3216 Metric); Packaging: TapeAndReel; PartId: 26856; Part Status: Active; Price: 0.08; Ratings: AEC-Q200; Resistance: 1 kOhms; Series: RNCS; Size / Dimension: 0.120" L x 0.061" W (3.05mm x 1.55mm); Supplier 1: DigiKey; Supplier Part Number 1: RNCS1206BKE1K00CT-ND; Supplier Device Package: 1206; Tolerance: ±0.1%; Value: 1 kOhms
R36-R39 = RMCF1210FT10K0: as R7 on sheet RIGHT_MOTOR; Part Number: RMCF1210FT10K0; ComponentLink1Description: Datasheet; ComponentLink1URL: https://www.seielect.com/catalog/sei-rmcf_rmcp.pdf; ComponentLink2Description: DigiKey Link; ComponentLink2URL: https://www.digikey.com/en/products/detail/stackpole-electronics-inc/RMCF1210FT10K0/1758528; Composition: Thick Film; Device Package: 1210 (3225 Metric); Features: Automotive AEC-Q200; Height - Seated (Max): 0.028" (0.70mm); LastUpdated: 17.12.2023 21:51:18; Lifecycle Status: Active; Minimum Order: 1; Number of Terminations: 2; Operating Temperature: -55°C ~ 155°C; Package / Case: 1210 (3225 Metric); Packaging: TapeAndReel; Part Status: Active; Price: 0.01; Ratings: AEC-Q200; Resistance: 10 kOhms; Series: RMCF; Size / Dimension: 0.126" L x 0.098" W (3.20mm x 2.50mm); Supplier 1: DigiKey; Supplier Part Number 1: RMCF1210FT10K0CT-ND; Supplier Device Package: 1210; Tolerance: ±1%; Value: 10 kOhms
R40 = RMCF1210FT330R: RES 330 OHM 1% 1/2W 1210; Manufacturer: Stackpole Electronics Inc; Power (Watts): 0.5W, 1/2W; Temperature Coefficient: ±100ppm/°C; Part Number: RMCF1210FT330R; ComponentLink1Description: Datasheet; ComponentLink1URL: https://www.seielect.com/catalog/sei-rmcf_rmcp.pdf; ComponentLink2Description: DigiKey Link; ComponentLink2URL: https://www.digikey.com/en/products/detail/stackpole-electronics-inc/RMCF1210FT330R/1715564; Composition: Thick Film; Device Package: 1210 (3225 Metric); Features: Automotive AEC-Q200; Height - Seated (Max): 0.028" (0.70mm); LastUpdated: 17.12.2023 21:51:11; Lifecycle Status: Active; Minimum Order: 1; Number of Terminations: 2; Operating Temperature: -55°C ~ 155°C; Package / Case: 1210 (3225 Metric); Packaging: TapeAndReel; Part Status: Active; Price: 0.01; Ratings: AEC-Q200; Resistance: 330 Ohms; Series: RMCF; Size / Dimension: 0.126" L x 0.098" W (3.20mm x 2.50mm); Supplier 1: DigiKey; Supplier Part Number 1: RMCF1210FT330RCT-ND; Supplier Device Package: 1210; Tolerance: ±1%; Value: 330 Ohms

## Nets that join several sheets
GND: RIGHT_MOTOR (18 pins), LEFT_MOTOR (18 pins), LOGIC AND POWER (19 pins)
VCC: RIGHT_MOTOR (14 pins), LEFT_MOTOR (14 pins), LOGIC AND POWER (5 pins)
+1: RIGHT_MOTOR (6 pins), LOGIC AND POWER (J7.1)
+2: LEFT_MOTOR (6 pins), LOGIC AND POWER (J7.3)
-1: RIGHT_MOTOR (5 pins), LOGIC AND POWER (J7.2)
-2: LEFT_MOTOR (5 pins), LOGIC AND POWER (J7.4)
NetIC1_3: RIGHT_MOTOR (R17.2), LOGIC AND POWER (IC1.3 IC2.3)
NetIC1_6: RIGHT_MOTOR (R2.1), LOGIC AND POWER (IC1.6 IC2.5)
NetIC1_8: LEFT_MOTOR (R34.2), LOGIC AND POWER (IC1.8 IC2.11)
NetIC1_11: LEFT_MOTOR (R19.1), LOGIC AND POWER (IC1.11 IC2.9)
NetIC2_4: RIGHT_MOTOR (R1.1), LOGIC AND POWER (IC2.4)
NetIC2_6: RIGHT_MOTOR (R16.2), LOGIC AND POWER (IC2.6)
NetIC2_8: LEFT_MOTOR (R33.2), LOGIC AND POWER (IC2.8)
NetIC2_10: LEFT_MOTOR (R18.1), LOGIC AND POWER (IC2.10)